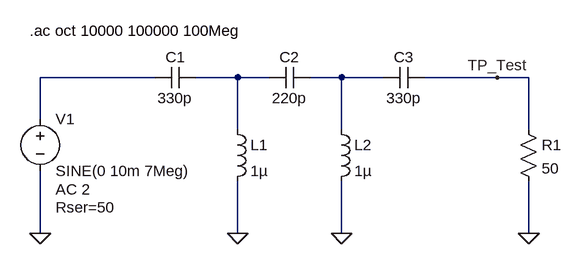
[diagram p0: schematic 4020 - HPF 6MHz 1.asc]
4020 - HPF 6MHz 1.asc, the LTspice schematic file:
Version 4
SHEET 1 1348 680
WIRE 208 96 32 96
WIRE 336 96 272 96
WIRE 384 96 336 96
WIRE 496 96 448 96
WIRE 560 96 496 96
WIRE 736 96 624 96
WIRE 784 96 736 96
WIRE 32 160 32 96
WIRE 336 176 336 96
WIRE 496 176 496 96
WIRE 784 176 784 96
WIRE 32 336 32 240
WIRE 336 336 336 256
WIRE 496 336 496 256
WIRE 784 336 784 256
FLAG 32 336 0
FLAG 784 336 0
FLAG 736 96 TP_Test
FLAG 496 336 0
FLAG 336 336 0
SYMBOL voltage 32 144 R0
WINDOW 123 24 124 Left 2
WINDOW 39 24 152 Left 2
SYMATTR Value2 AC 2
SYMATTR SpiceLine Rser=50
SYMATTR InstName V1
SYMATTR Value SINE(0 10m 7Meg)
SYMBOL res 768 160 R0
SYMATTR InstName R1
SYMATTR Value 50
SYMBOL cap 272 80 R90
WINDOW 0 0 32 VBottom 2
WINDOW 3 32 32 VTop 2
SYMATTR InstName C1
SYMATTR Value 330p
SYMBOL ind 320 160 R0
SYMATTR InstName L1
SYMATTR Value 1µ
SYMBOL cap 448 80 R90
WINDOW 0 0 32 VBottom 2
WINDOW 3 32 32 VTop 2
SYMATTR InstName C2
SYMATTR Value 220p
SYMBOL cap 624 80 R90
WINDOW 0 0 32 VBottom 2
WINDOW 3 32 32 VTop 2
SYMATTR InstName C3
SYMATTR Value 330p
SYMBOL ind 480 160 R0
SYMATTR InstName L2
SYMATTR Value 1µ
TEXT 16 24 Left 2 !.ac oct 10000 100000 100Meg

The netlist it stands for:
* 4020 - HPF 6MHz 1.asc
V1 N001 0 SINE(0 10m 7Meg) AC 2 Rser=50
R1 TP_Test 0 50
C1 N002 N001 330p
L1 N002 0 1µ
C2 N003 N002 220p
C3 TP_Test N003 330p
L2 N003 0 1µ
.ac oct 10000 100000 100Meg
.backanno
.end